# EAGLE design rapidshark-motor-contor-fault-display-mk-1.0 (EAGLE 7.5.0)
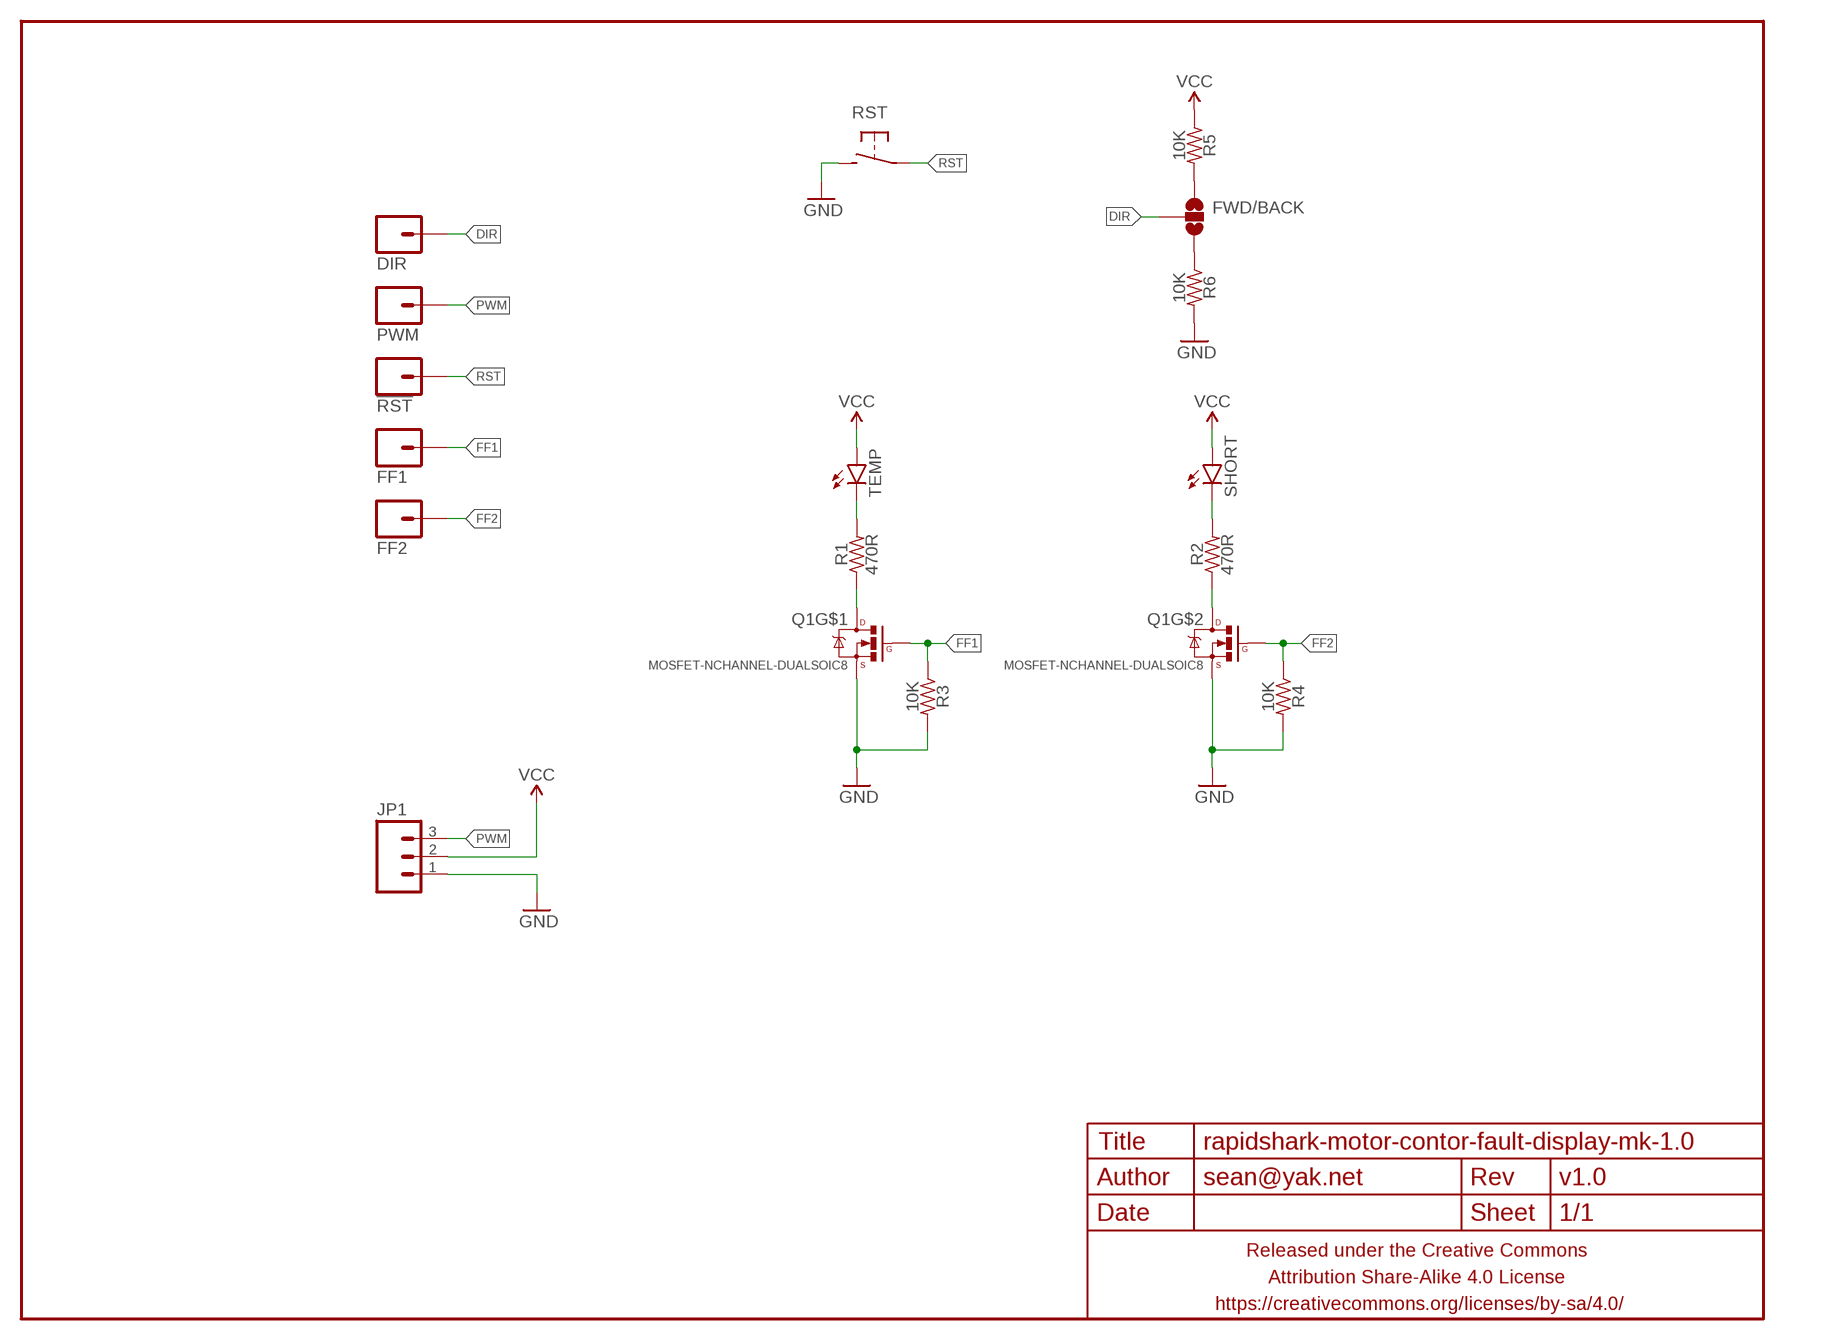
[diagram p0: schematic, sheet 1]

## Parts
!RST  M01PTH  [1X01]
DIR  M01PTH  [1X01]
FF1  M01PTH  [1X01]
FF2  M01PTH  [1X01]
FRAME1  FRAME-LETTERNO_PACKAGE  [DUMMY]
FWD/BACK  JUMPER-PAD-3-NOFULL_BOX_SILK  [PAD-JUMPER-3-NO_YES_SILK_FULL_BOX]
JP1  M03PTH-CENTERED  [1X03-CENTERED]
PWM  M01PTH  [1X01]
Q1  MOSFET-NCHANNEL-DUALSOIC8  [SO08]
R1  470R  RESISTORR0603-TIGHTER  [R0603-TIGHTER]
R2  470R  RESISTORR0603-TIGHTER  [R0603-TIGHTER]
R3  10K  RESISTORR0603-TIGHTER  [R0603-TIGHTER]
R4  10K  RESISTORR0603-TIGHTER  [R0603-TIGHTER]
R5  10K  RESISTORR0603-TIGHTER  [R0603-TIGHTER]
R6  10K  RESISTORR0603-TIGHTER  [R0603-TIGHTER]
RST  SPST-NO-TACTCK-PTS840-GK  [TACTILE-SMD-CK-PTS840-GK]
SHORT  LED0603-TIGHT  [LED-0603-TIGHT]
TEMP  LED0603-TIGHT  [LED-0603-TIGHT]

## Nets
DIR: DIR.1 FWD/BACK.2
FF1: FF1.1 Q1.2(G) R3.1
FF2: FF2.1 Q1.4(G) R4.1
GND: JP1.1 Q1.1(S) Q1.3(S) R3.2 R4.2 R6.2 RST.3 RST.4
N$1: R1.2 TEMP.C
N$2: Q1.7(D) Q1.8(D) R1.1
N$3: R2.2 SHORT.C
N$4: Q1.5(D) Q1.6(D) R2.1
N$5: FWD/BACK.1 R5.2
N$6: FWD/BACK.3 R6.1
PWM: JP1.3 PWM.1
RST: !RST.1 RST.1 RST.2
VCC: JP1.2 R5.1 SHORT.A TEMP.A

## Library data of the parts
!RST DIR FF1 FF2 PWM = a_parts:M01: Header 1 Standard 1-pin 0.1" header. Use with straight break away headers (SKU : PRT-00116), right angle break away headers (PRT-00553), swiss pins (PRT-00743), machine pins (PRT-00117), and female headers (PRT-00115).
FRAME1 = A_butts:FRAME-LETTER: Schematic Frame Standard 8.5x11 US Letter frame; DESIGNER: sean@yak.net; VERSION: v1.0
FWD/BACK = a_parts:JUMPER-PAD-3-NO
JP1 = a_parts:M03: Header 3 Standard 3-pin 0.1" header. Use with straight break away headers (SKU : PRT-00116), right angle break away headers (PRT-00553), swiss pins (PRT-00743), machine pins (PRT-00117), and female headers (PRT-00115). Molex polarized connector foot print use with SKU : PRT-08232 with associated crimp pins and housings.
Q1 = a_parts:MOSFET-NCHANNEL-DUAL
R1-R6 = a_parts:RESISTOR: RESISTOR, American symbol
RST = a_parts:SPST-NO-TACT
SHORT TEMP = a_parts:LED: LEDs Standard schematic elements and footprints for 5mm, 3mm, 1206, and 0603 sized LEDs. 5mm - Spark Fun Electronics SKU : COM-00529 (and others)

## Board
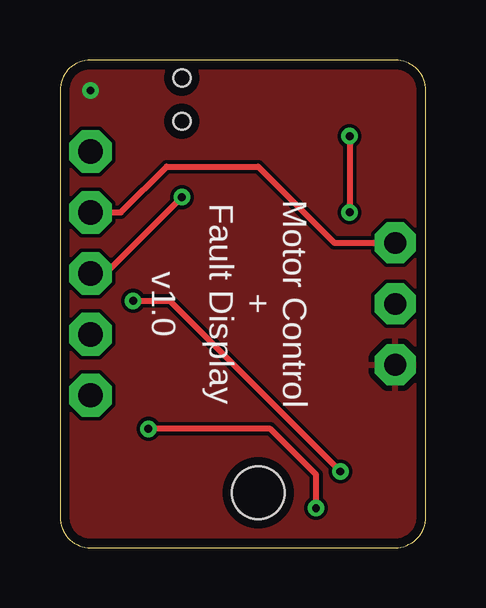
[diagram p1: board, top side]
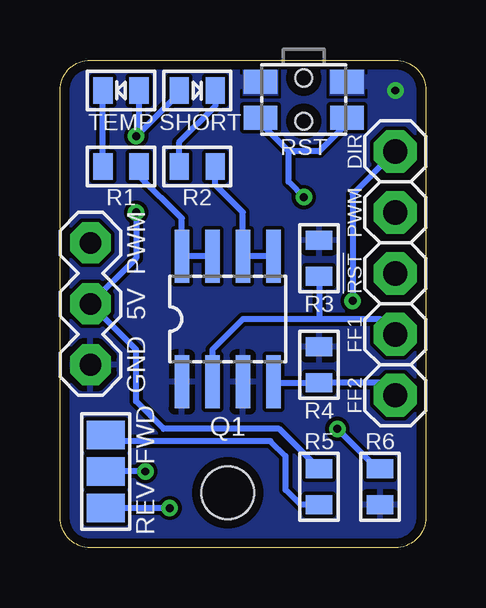
[diagram p2: board, bottom side, seen from below]

Size 15.24 x 20.32 mm. Coordinates in mm from the lower left corner, seen from the top.
Outline: 0,19.05 0,1.27 arc90 1.27,0 13.97,0 arc90 15.24,1.27 15.24,19.05 arc90 13.97,20.32 1.27,20.32 arc90 0,19.05
Copper layers (1*16): Top 0.0356mm / dielectric 1.5011mm / Bottom 0.0356mm
Design rules "LaenPCBOrder_2": minimum track width 6mil, minimum drill 13mil, track to track 6mil, track to pad 6mil, pad to pad 6mil, via to via 6mil, smd to smd 6mil, copper to edge 15mil, drill to drill 6mil, minimum pad ring 7mil, minimum via ring 7mil, stop-mask expansion 3mil, vias tented up to drill 20mil, thermal gap 10mil
Holes 2.2 mm at 8.26,2.29

### Footprints (pad centres in the part's own frame; a part is rotated, then mirrored left to right if it is on the bottom)
1X01 = drill 1.016 pad 1.778 octagon: 1 0,0
PAD-JUMPER-3-NO_YES_SILK_FULL_BOX = smd 1.2 x 1.6: 1 -1.524,0; 2 0,0; 3 1.524,0
1X03-CENTERED = drill 0.9 pad 1.7 octagon: 1 -2.54,0; 2 0,0; 3 2.54,0
SO08 = smd 0.61 x 2.21: 1 -1.905,-2.616; 2 -0.635,-2.616; 3 0.635,-2.616; 4 1.905,-2.616; 5 1.905,2.616; 6 0.635,2.616; 7 -0.635,2.616; 8 -1.905,2.616
R0603-TIGHTER = smd 0.8 x 1.1: 1 -0.75,0; 2 0.75,0
TACTILE-SMD-CK-PTS840-GK = smd 1.4 x 1: 1 -1.8,0.75; 2 1.8,0.75; 3 -1.8,-0.75; 4 1.8,-0.75 | hole 0.7: 0,-0.9; 0,0.9
LED-0603-TIGHT = smd 0.8 x 1.1: A 0.75,0; C -0.75,0

### Placement (x,y rotation side)
!RST  1.27,11.43 90 bottom
DIR  1.27,16.51 90 bottom
FF1  1.27,8.89 90 bottom
FF2  1.27,6.35 90 bottom
FRAME1  0,0 0 top
FWD/BACK  13.34,3.17 270 bottom
JP1  13.97,10.16 90 bottom
PWM  1.27,13.97 90 bottom
Q1  8.26,9.53 0 bottom
R1  12.7,15.88 180 bottom
R2  9.53,15.88 180 bottom
R3  4.45,12.06 90 bottom
R4  4.45,7.62 90 bottom
R5  4.45,2.54 270 bottom
R6  1.91,2.54 270 bottom
RST  5.08,18.67 180 bottom
SHORT  9.53,19.05 180 bottom
TEMP  12.7,19.05 0 bottom

### Tracks (layer width: path | path; a pad name or v marks a point on that pad's centre or on a via)
DIR  (via drill 0.33)
  Top 0.254: v3.05,10.29 4.57,10.29 v11.68,3.17
  Bottom 0.254: DIR.1 3.05,14.73 v3.05,10.29 | v11.68,3.17 FWD/BACK.2
FF1
  Bottom 0.254: FF1.1 1.91,9.53 4.45,9.53 | 4.45,9.53 7.62,9.53 8.89,8.26 Q1.2 | R3.1 4.45,9.53
FF2
  Bottom 0.254: Q1.4 6.31,6.87 R4.1 1.79,6.87 FF2.1
GND  (via drill 0.33)
  other vias: 1.27,19.05
  pour Top: 13.97,0 1.27,0 arc-90 0,1.27 0,19.05 arc-90 1.27,20.32 13.97,20.32 arc-90 15.24,19.05 15.24,1.27 arc-90
  pour Bottom: 13.97,0 1.27,0 arc-90 0,1.27 0,19.05 arc-90 1.27,20.32 13.97,20.32 arc-90 15.24,19.05 15.24,1.27 arc-90
N$1
  Bottom 0.254: R1.2 TEMP.C
N$2
  Bottom 0.254: Q1.7 Q1.8 10.16,13.72 11.95,15.51 R1.1
N$3
  Bottom 0.254: SHORT.C 8.78,18.4 10.29,16.89 R2.2
N$4
  Bottom 0.254: Q1.5 Q1.6 7.62,13.97 8.78,15.12 R2.1
N$5
  Bottom 0.254: R5.2 5.22,1.79 5.84,2.41 5.84,3.81 6.48,4.45 12.7,4.45 12.95,4.7 FWD/BACK.1
N$6  (via drill 0.33)
  Top 0.254: v10.67,1.65 10.67,3.05 8.76,4.95 v3.68,4.95
  Bottom 0.254: R6.1 2.02,3.29 v3.68,4.95 | v10.67,1.65 FWD/BACK.3
PWM
  Top 0.254: PWM.1 2.54,13.97 4.45,15.88 8.26,15.88 11.43,12.7 JP1.3
RST  (via drill 0.33)
  Top 0.254: v5.08,14.61 1.91,11.43 !RST.1
  Bottom 0.254: RST.2 6.88,17.68 5.71,16.51 | RST.1 3.28,17.68 4.45,16.51 5.71,16.51 | v5.08,14.61 5.71,15.24 5.71,16.51
VCC  (via drill 0.33)
  Top 0.254: v12.06,17.14 v12.06,13.97
  Bottom 0.254: TEMP.A 11.95,17.26 v12.06,17.14 10.28,18.93 SHORT.A | v12.06,13.97 12.06,12.06 JP1.2 12.06,8.26 12.06,6.1 10.92,4.95 6.11,4.95 R5.1

### Text on the board
tPlace: Motor Control / + / Fault Display
bPlace: PWM | 5V | GND | FWD | REV